# Altium schematic sheet FPGA_SDRAM.SchDoc: =ProjectName
size 420 x 297 mm; Author: G.K.; CompanyName: WUT; DrawnBy: G.K. and P.K.; Organization: WUT ISE; Address1: Warsaw Univeristy of Technology; Address2: Nowowiejska 15/19; DocumentNumber: 8; Revision: 1.1; SheetNumber: 8; SheetTotal: 12; EDA_Number: ARTIQ; Projet: ARTIQ/SINARA; ModifiedBy: -; CreateDate: XX/XX/XXXX; CheckedDate: -; Title2: FPGA_SDRAM.SchDoc; DivGrp: ISE; Designer: G.K. and P.K.; ModifiedDate: -; ProjectName: ARTIQ/SINARA
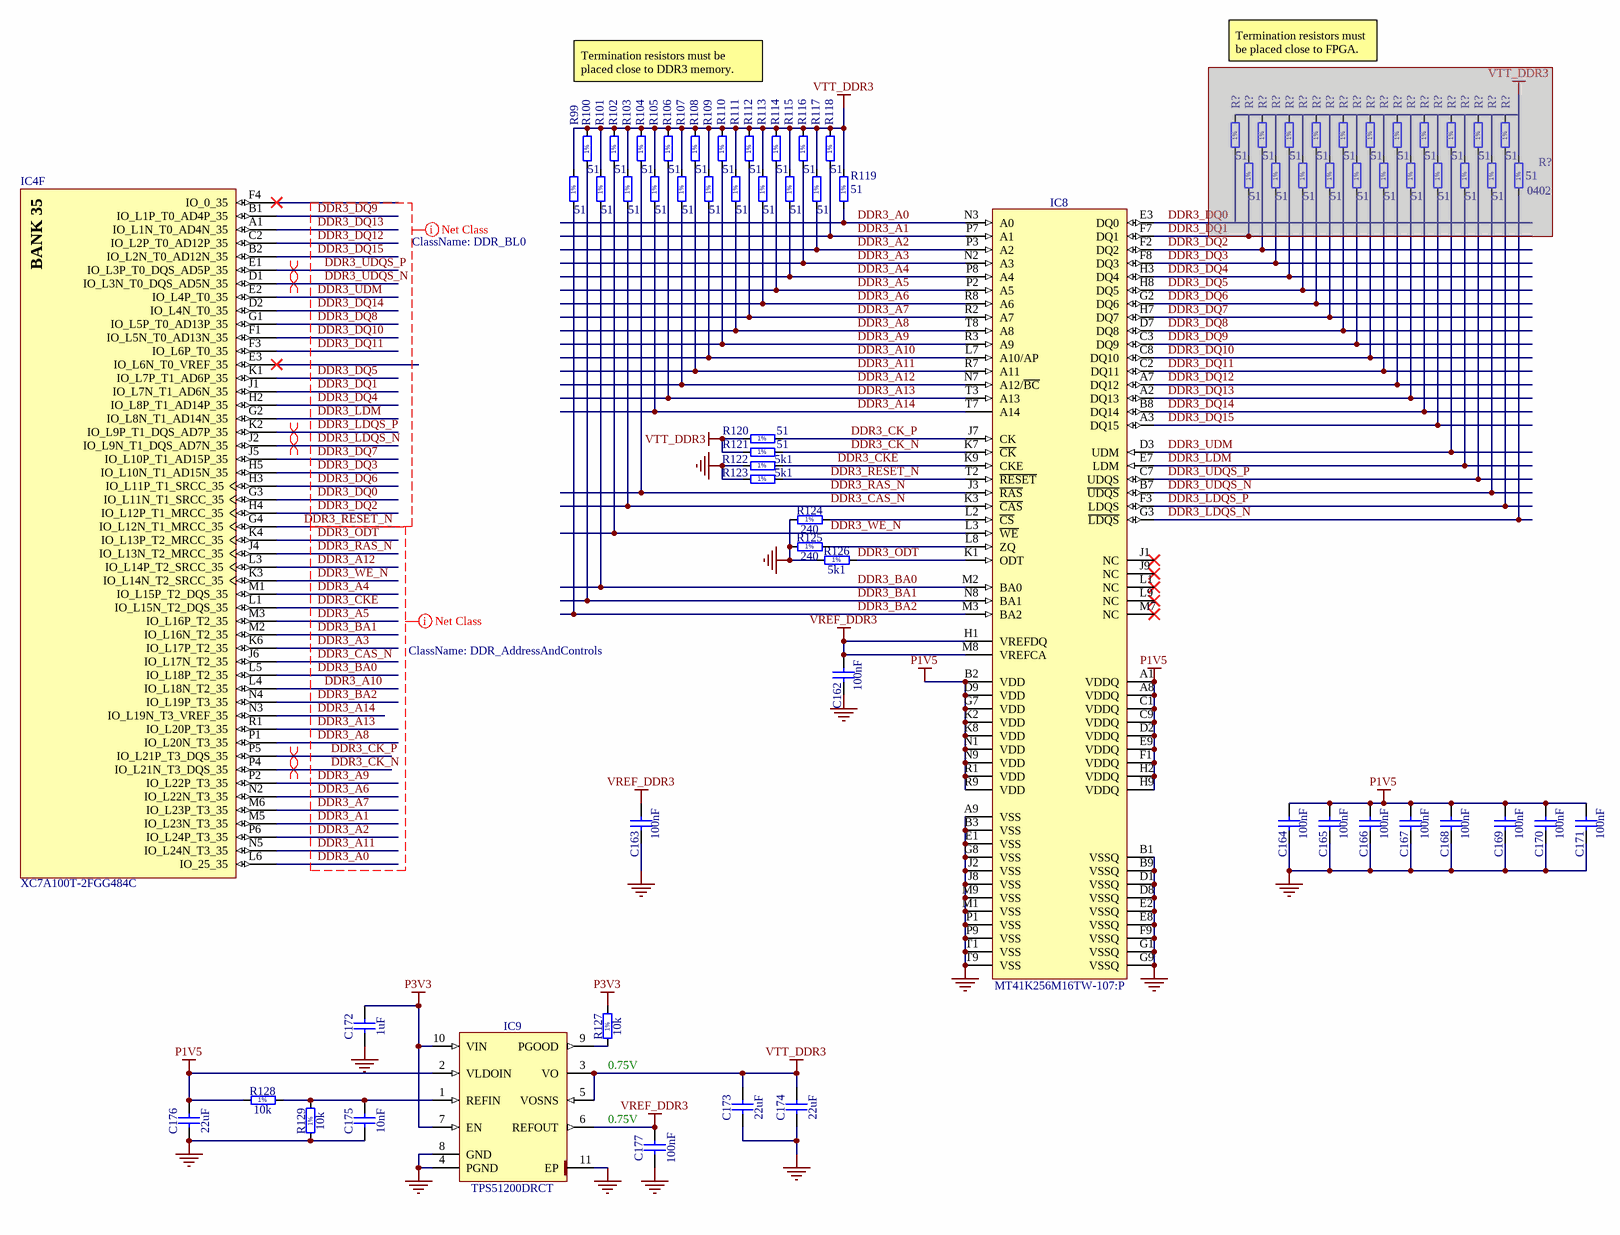
[diagram p0: FPGA_SDRAM.SchDoc]

## Parts
(Parts that share a designator on the sheet are numbered #1, #2 ... from top to bottom, then left to right.)
C162  100nF  [CAPC0603X33N]
C163  100nF  [CAPC0603X33N]
C164  100nF  [CAPC0603X33N]
C165  100nF  [CAPC0603X33N]
C166  100nF  [CAPC0603X33N]
C167  100nF  [CAPC0603X33N]
C168  100nF  [CAPC0603X33N]
C169  100nF  [CAPC0603X33N]
C170  100nF  [CAPC0603X33N]
C171  100nF  [CAPC0603X33N]
C172  1uF  [CAPC1005X55N]
C173  22uF  [CAPC1709X100N]
C174  22uF  [CAPC1709X100N]
C175  10nF  [CAPC1005X55N]
C176  22uF  [CAPC1709X100N]
C177  100nF  [CAPC0603X33N]
IC4  XC7A100T-2FGG484C  [FGG484]  (part F of 10)
IC8  MT41K256M16TW-107:P  [BGA96C80P9X16_800X1400X120]
IC9  TPS51200DRCT  [TEXAS_DRC (S-PVSON-N10)]
R99  51  [RESC1005X40N]
R100  51  [RESC1005X40N]
R101  51  [RESC1005X40N]
R102  51  [RESC1005X40N]
R103  51  [RESC1005X40N]
R104  51  [RESC1005X40N]
R105  51  [RESC1005X40N]
R106  51  [RESC1005X40N]
R107  51  [RESC1005X40N]
R108  51  [RESC1005X40N]
R109  51  [RESC1005X40N]
R110  51  [RESC1005X40N]
R111  51  [RESC1005X40N]
R112  51  [RESC1005X40N]
R113  51  [RESC1005X40N]
R114  51  [RESC1005X40N]
R115  51  [RESC1005X40N]
R116  51  [RESC1005X40N]
R117  51  [RESC1005X40N]
R118  51  [RESC1005X40N]
R119  51  [RESC1005X40N]
R120  51  [RESC1005X40N]
R121  51  [RESC1005X40N]
R122  5k1  [RESC1005X40N]
R123  5k1  [RESC1005X40N]
R124  240  [RESC1005X40N]
R125  240  [RESC1005X40N]
R126  5k1  [RESC1005X40N]
R127  10k  [RESC1005X40N]
R128  10k  [RESC1005X40N]
R129  10k  [RESC1005X40N]
R?#1  51  [RESC1005X40N]  (masked out: inside a compile mask, not in the netlist)
R?#2  51  [RESC1005X40N]  (masked out: inside a compile mask, not in the netlist)
R?#3  51  [RESC1005X40N]  (masked out: inside a compile mask, not in the netlist)
R?#4  51  [RESC1005X40N]  (masked out: inside a compile mask, not in the netlist)
R?#5  51  [RESC1005X40N]  (masked out: inside a compile mask, not in the netlist)
R?#6  51  [RESC1005X40N]  (masked out: inside a compile mask, not in the netlist)
R?#7  51  [RESC1005X40N]  (masked out: inside a compile mask, not in the netlist)
R?#8  51  [RESC1005X40N]  (masked out: inside a compile mask, not in the netlist)
R?#9  51  [RESC1005X40N]  (masked out: inside a compile mask, not in the netlist)
R?#10  51  [RESC1005X40N]  (masked out: inside a compile mask, not in the netlist)
R?#11  51  [RESC1005X40N]  (masked out: inside a compile mask, not in the netlist)
R?#12  51  [RESC1005X40N]  (masked out: inside a compile mask, not in the netlist)
R?#13  51  [RESC1005X40N]  (masked out: inside a compile mask, not in the netlist)
R?#14  51  [RESC1005X40N]  (masked out: inside a compile mask, not in the netlist)
R?#15  51  [RESC1005X40N]  (masked out: inside a compile mask, not in the netlist)
R?#16  51  [RESC1005X40N]  (masked out: inside a compile mask, not in the netlist)
R?#17  51  [RESC1005X40N]  (masked out: inside a compile mask, not in the netlist)
R?#18  51  [RESC1005X40N]  (masked out: inside a compile mask, not in the netlist)
R?#19  51  [RESC1005X40N]  (masked out: inside a compile mask, not in the netlist)
R?#20  51  [RESC1005X40N]  (masked out: inside a compile mask, not in the netlist)
R?#21  51  [RESC1005X40N]  (masked out: inside a compile mask, not in the netlist)
R?#22  51  Case: 0402  [RESC1005X40N]  (masked out: inside a compile mask, not in the netlist)

## Nets
GND: C162.1 C163.1 C164.1 C165.1 C166.1 C167.1 C168.1 C169.1 C170.1 C171.1 C172.1 C173.1 C174.1 C175.1 C176.1 C177.1 IC8.A9(VSS) IC8.B1(VSSQ) IC8.B3(VSS) IC8.B9(VSSQ) IC8.D1(VSSQ) IC8.D8(VSSQ) IC8.E1(VSS) IC8.E2(VSSQ) IC8.E8(VSSQ) IC8.F9(VSSQ) IC8.G1(VSSQ) IC8.G8(VSS) IC8.G9(VSSQ) IC8.J2(VSS) IC8.J8(VSS) IC8.M1(VSS) IC8.M9(VSS) IC8.P1(VSS) IC8.P9(VSS) IC8.T1(VSS) IC8.T9(VSS) IC9.4(PGND) IC9.8(GND) IC9.11(EP) R122.1 R123.1 R124.1 R125.1 R126.1 R129.1
P1V5: C164.2 C165.2 C166.2 C167.2 C168.2 C169.2 C170.2 C171.2 C176.2 IC8.A1(VDDQ) IC8.A8(VDDQ) IC8.B2(VDD) IC8.C1(VDDQ) IC8.C9(VDDQ) IC8.D2(VDDQ) IC8.D9(VDD) IC8.E9(VDDQ) IC8.F1(VDDQ) IC8.G7(VDD) IC8.H2(VDDQ) IC8.H9(VDDQ) IC8.K2(VDD) IC8.K8(VDD) IC8.N1(VDD) IC8.N9(VDD) IC8.R1(VDD) IC8.R9(VDD) IC9.2(VLDOIN) R128.1
P3V3: C172.2 IC9.7(EN) IC9.10(VIN) R127.2
VREF_DDR3: C162.2 C163.2 C177.2 IC8.H1(VREFDQ) IC8.M8(VREFCA) IC9.6(REFOUT)
VTT_DDR3: C173.2 C174.2 IC9.3(VO) IC9.5(VOSNS) R99.2 R100.2 R101.2 R102.2 R103.2 R104.2 R105.2 R106.2 R107.2 R108.2 R109.2 R110.2 R111.2 R112.2 R113.2 R114.2 R115.2 R116.2 R117.2 R118.2 R119.2 R120.1 R121.1
DDR3_A0: IC4.L6(IO_25_35) IC8.N3(A0) R119.1
DDR3_A1: IC4.M5(IO_L23N_T3_35) IC8.P7(A1) R118.1
DDR3_A2: IC4.P6(IO_L24P_T3_35) IC8.P3(A2) R117.1
DDR3_A3: IC4.K6(IO_L17P_T2_35) IC8.N2(A3) R116.1
DDR3_A4: IC4.M1(IO_L15P_T2_DQS_35) IC8.P8(A4) R115.1
DDR3_A5: IC4.M3(IO_L16P_T2_35) IC8.P2(A5) R114.1
DDR3_A6: IC4.N2(IO_L22N_T3_35) IC8.R8(A6) R113.1
DDR3_A7: IC4.M6(IO_L23P_T3_35) IC8.R2(A7) R112.1
DDR3_A8: IC4.P1(IO_L20N_T3_35) IC8.T8(A8) R111.1
DDR3_A9: IC4.P2(IO_L22P_T3_35) IC8.R3(A9) R110.1
DDR3_A10: IC4.L4(IO_L18N_T2_35) IC8.L7(A10/AP) R109.1
DDR3_A11: IC4.N5(IO_L24N_T3_35) IC8.R7(A11) R108.1
DDR3_A12: IC4.L3(IO_L14P_T2_SRCC_35) IC8.N7(A12/~{BC}) R107.1
DDR3_A13: IC4.R1(IO_L20P_T3_35) IC8.T3(A13) R106.1
DDR3_A14: IC4.N3(IO_L19N_T3_VREF_35) IC8.T7(A14) R105.1
DDR3_BA0: IC4.L5(IO_L18P_T2_35) IC8.M2(BA0) R101.1
DDR3_BA1: IC4.M2(IO_L16N_T2_35) IC8.N8(BA1) R100.1
DDR3_BA2: IC4.N4(IO_L19P_T3_35) IC8.M3(BA2) R99.1
DDR3_CAS_N: IC4.J6(IO_L17N_T2_35) IC8.K3(~{CAS}) R103.1
DDR3_CK_N: IC4.P4(IO_L21N_T3_DQS_35) IC8.K7(~{CK}) R121.2
DDR3_CK_P: IC4.P5(IO_L21P_T3_DQS_35) IC8.J7(CK) R120.2
DDR3_CKE: IC4.L1(IO_L15N_T2_DQS_35) IC8.K9(CKE) R122.2
DDR3_DQ0: IC4.G3(IO_L11N_T1_SRCC_35) IC8.E3(DQ0)
DDR3_DQ1: IC4.J1(IO_L7N_T1_AD6N_35) IC8.F7(DQ1)
DDR3_DQ2: IC4.H4(IO_L12P_T1_MRCC_35) IC8.F2(DQ2)
DDR3_DQ3: IC4.H5(IO_L10N_T1_AD15N_35) IC8.F8(DQ3)
DDR3_DQ4: IC4.H2(IO_L8P_T1_AD14P_35) IC8.H3(DQ4)
DDR3_DQ5: IC4.K1(IO_L7P_T1_AD6P_35) IC8.H8(DQ5)
DDR3_DQ6: IC4.H3(IO_L11P_T1_SRCC_35) IC8.G2(DQ6)
DDR3_DQ7: IC4.J5(IO_L10P_T1_AD15P_35) IC8.H7(DQ7)
DDR3_DQ8: IC4.G1(IO_L5P_T0_AD13P_35) IC8.D7(DQ8)
DDR3_DQ9: IC4.B1(IO_L1P_T0_AD4P_35) IC8.C3(DQ9)
DDR3_DQ10: IC4.F1(IO_L5N_T0_AD13N_35) IC8.C8(DQ10)
DDR3_DQ11: IC4.F3(IO_L6P_T0_35) IC8.C2(DQ11)
DDR3_DQ12: IC4.C2(IO_L2P_T0_AD12P_35) IC8.A7(DQ12)
DDR3_DQ13: IC4.A1(IO_L1N_T0_AD4N_35) IC8.A2(DQ13)
DDR3_DQ14: IC4.D2(IO_L4N_T0_35) IC8.B8(DQ14)
DDR3_DQ15: IC4.B2(IO_L2N_T0_AD12N_35) IC8.A3(DQ15)
DDR3_LDM: IC4.G2(IO_L8N_T1_AD14N_35) IC8.E7(LDM)
DDR3_LDQS_N: IC4.J2(IO_L9N_T1_DQS_AD7N_35) IC8.G3(~{LDQS})
DDR3_LDQS_P: IC4.K2(IO_L9P_T1_DQS_AD7P_35) IC8.F3(LDQS)
DDR3_ODT: IC4.K4(IO_L13P_T2_MRCC_35) IC8.K1(ODT) R126.2
DDR3_RAS_N: IC4.J4(IO_L13N_T2_MRCC_35) IC8.J3(~{RAS}) R104.1
DDR3_RESET_N: IC4.G4(IO_L12N_T1_MRCC_35) IC8.T2(~{RESET}) R123.2
DDR3_UDM: IC4.E2(IO_L4P_T0_35) IC8.D3(UDM)
DDR3_UDQS_N: IC4.D1(IO_L3N_T0_DQS_AD5N_35) IC8.B7(~{UDQS})
DDR3_UDQS_P: IC4.E1(IO_L3P_T0_DQS_AD5P_35) IC8.C7(UDQS)
DDR3_WE_N: IC4.K3(IO_L14N_T2_SRCC_35) IC8.L3(~{WE}) R102.1
NetC175_2: C175.2 IC9.1(REFIN) R128.2 R129.2
NetIC8_L2: IC8.L2(~{CS}) R124.2
NetIC8_L8: IC8.L8(ZQ) R125.2
NetIC9_9: IC9.9(PGOOD) R127.1

Not connected (* = marked no-connect by the designer): IC4 E3(IO_L6N_T0_VREF_35)* F4(IO_0_35)*; IC8 J1(NC)* J9(NC)* L1(NC)* L9(NC)* M7(NC)*

## Layout directives
differential pair: DDR3_CK_N, DDR3_CK_P, DDR3_LDQS_N, DDR3_LDQS_P, DDR3_UDQS_N, DDR3_UDQS_P
net class DDR_AddressAndControls; net class 50Ohm: DDR3_A0, DDR3_A1, DDR3_A2, DDR3_A3, DDR3_A4, DDR3_A5, DDR3_A6, DDR3_A7, DDR3_A8, DDR3_A9, DDR3_A10, DDR3_A11, DDR3_A12, DDR3_A13, DDR3_A14, DDR3_BA0, DDR3_BA1, DDR3_BA2, DDR3_CAS_N, DDR3_CK_N, DDR3_CK_P, DDR3_CKE, DDR3_ODT, DDR3_RAS_N, DDR3_WE_N
net class DDR_BL0; net class 50Ohm: DDR3_DQ0, DDR3_DQ1, DDR3_DQ2, DDR3_DQ3, DDR3_DQ4, DDR3_DQ5, DDR3_DQ6, DDR3_DQ7, DDR3_DQ8, DDR3_DQ9, DDR3_DQ10, DDR3_DQ11, DDR3_DQ12, DDR3_DQ13, DDR3_DQ14, DDR3_DQ15, DDR3_LDM, DDR3_LDQS_N, DDR3_LDQS_P, DDR3_UDM, DDR3_UDQS_N, DDR3_UDQS_P

## Notes on the sheet
- Termination resistors must be placed close to FPGA.
- Termination resistors must be placed close to DDR3 memory.
- (near R127) 0.75V
- (near C177) 0.75V
- (in symbol CMP-0364-00026-3, part F) BANK 35
- (in symbol R0402_5K1_1%_0.0625W_100PPM) 1%
- (in symbol R0402_10K_1%_0.0625W_100PPM) 1%
- (in symbol R0402_51R_1%_0.0625W_100PPM) 1%
- (in symbol R0402_240R_1%_0.0625W_100PPM) 1%

## Library data of the parts
C162-C171 C177 = CC0201_100NF_6.3V_10%_X5R: Non-polarised capacitor; Part Description: SMD Multilayer Chip Ceramic Capacitor; Manufacturer: GENERIC; Manufacturer1 Part Number: 02016D104KAT2A; Voltage: 6.3V; TC: X5R; Tolerance: ±10%; Part Number: CC0201_100NF_6.3V_10%_X5R; Component Kind: Standard; Component Type: Standard; Pin Count: 2; Value: 100nF; Status: Not Recommended; Manufacturer Part Number: CC0201_100NF_6.3V_10%_X5R; Case: 0201; Mounted: Yes; Socket: No; SMD: Yes; Sense: No; Manufacturer1 Example: AVX; Manufacturer1 ComponentHeight: 0.33mm; HelpURL: \\cern.ch\dfs\Applications\Altium\Datasheets\CC0201_X5R_AVX.pdf; Author: CERN DEM JLC
  C162-C171: CreateDate: 2007-12-03; LatestRevisionDate: 2007-12-03
  C177: CreateDate: 03.12.2007; LatestRevisionDate: 03.12.2007
C172 = CC0402_1UF_16V_10%_X5R: Non-polarised capacitor; Part Description: SMD Multilayer Chip Ceramic Capacitor; Manufacturer: GENERIC; Manufacturer1 Part Number: C1005X5R1C105KT; Voltage: 16V; TC: X5R; Tolerance: ±10%; Part Number: CC0402_1UF_16V_10%_X5R; Component Kind: Standard; Component Type: Standard; Pin Count: 2; Value: 1uF; Status: Preferred; Manufacturer Part Number: CC0402_1UF_16V_10%_X5R; Case: 0402; Mounted: Yes; Socket: No; SMD: Yes; Manufacturer1 Example: TDK; Manufacturer1 ComponentHeight: 0.55mm; HelpURL: \\cern.ch\dfs\Applications\Altium\Datasheets\CC0402_X5R_TDK_C.pdf; Author: CERN DEM JLC; CreateDate: 25.10.2012; LatestRevisionDate: 25.10.2012; Sense: No
C173 C174 C176 = CC0603_22UF_6.3V_20%_X5R: Non-polarised capacitor; Part Description: SMD Multilayer Chip Ceramic Capacitor; Manufacturer: GENERIC; Manufacturer1 Part Number: C1608X5R0J226M080AC; Voltage: 6.3V; TC: X5R; Tolerance: ±20%; Part Number: CC0603_22UF_6.3V_20%_X5R; Component Kind: Standard; Component Type: Standard; Pin Count: 2; Value: 22uF; Status: None; Manufacturer Part Number: CC0603_22UF_6.3V_20%_X5R; Case: 0603; Mounted: Yes; Socket: No; SMD: Yes; Manufacturer1 Example: TDK; Manufacturer1 ComponentHeight: 1mm; HelpURL: \\cern.ch\dfs\Applications\Altium\Datasheets\CC0603_X5R_TDK_C.pdf; Author: CERN DEM JLC; CreateDate: 16.12.2013; LatestRevisionDate: 13.09.2016; Sense: No
C175 = CC0402_10NF_16V_10%_X7R: Non-polarised capacitor; Part Description: SMD Multilayer Chip Ceramic Capacitor; Manufacturer: GENERIC; Manufacturer1 Part Number: 223878715636; Voltage: 16V; TC: X7R; Tolerance: ±10%; Part Number: CC0402_10NF_16V_10%_X7R; Component Kind: Standard; Component Type: Standard; Pin Count: 2; Value: 10nF; Status: Not Recommended; Manufacturer Part Number: CC0402_10NF_16V_10%_X7R; Case: 0402; Mounted: Yes; Socket: No; SMD: Yes; Manufacturer1 Example: PHYCOMP; Manufacturer1 ComponentHeight: 0.55mm; HelpURL: \\cern.ch\dfs\Applications\Altium\Datasheets\CC0402_X7R_PHYCOMP.pdf; Author: CERN DEM JLC; CreateDate: 03.12.2007; LatestRevisionDate: 03.12.2007; Sense: No
IC4 = CMP-0364-00026-3: Artix-7 FPGA, 285 User I/Os, 4 GTP, 484-Ball BGA, Speed Grade 2, Commercial Grade, Pb-Free; Manufacturer: Xilinx; Max User I/O: 300; Clock Mgmt Tiles (CMTs): 6; Logic Cells: 101440; Block RAM Blocks (36Kb): 135; Block RAM Blocks (18Kb): 270; Speed Grade: -2; CLBs (Slices): 15850; Block RAM Blocks (Max Kb): 4860; DSP48E1 Slices: 240; RoHS: Pb-Free; ComponentLink3URL: http://www.xilinx.com/support/documentation/data_sheets/ds181_Artix_7_Data_Sheet.pdf; NexusDeviceID: XC7A100T-2FGG484C; DatasheetVersion: v1.12; Mounting Technology: Surface Mount; PackageDescription: Wire-Bond Fine-Pitch BGA, Body 23 x 23 mm, 1.0 mm Pitch; PackageReference: FGG484; ComponentLink2Description: Package Specification; Code_JEDEC: MS-034-AAJ-1; ComponentLink2URL: http://www.xilinx.com/support/documentation/user_guides/ug475_7Series_Pkg_Pinout.pdf; ComponentLink3Description: DC and Switching Characteristics; Generic Part Number: XC7A100T; ComponentLink4Description: Package File; ComponentLink4URL: http://www.xilinx.com/support/packagefiles/a7packages/xc7a100tfgg484pkg.txt; ComponentLink1URL: http://www.xilinx.com/support/documentation/data_sheets/ds180_7Series_Overview.pdf; PartNumber: XC7A100T-2FGG484C; ComponentLink5URL: http://www.xilinx.com/support/documentation/user_guides/ug475_7Series_Pkg_Pinout.pdf; PackageVersion: Rev 1.8; ComponentLink5Description: Packaging and Pinout; ComponentLink1Description: Datasheet; CLBs (Max Distributed RAM Kb): 1188; ClassName: Artix
IC8 = MT41K256M16TW-107:P: 32 Meg x 16 x 8 Banks DDR3L SDRAM; Part Description: +1.5V, 4Gb (32Meg x 16 x 8 banks) DDR3L SDRAM; Manufacturer: MICRON TECHNOLOGY; PressFit: No; Bonding: No; Part Number: MT41K256M16TW-107:P; Component Kind: Standard; Component Type: Standard; Device: MT41K256M16TW-107:P; PackageDescription: BGA 0.8mm, Pitch, Square 96 Pin, 9 Columns x 16 Rows, Body 14mm X 8mm X 1.2mm H; Manufacturer Part Number: MT41K256M16TW-107:P; Pin Count: 96; Case: BGA96; Mounted: Yes; Socket: No; SMD: Yes; Sense: No; ComponentHeight: 1.2mm; HelpURL: \\cern.ch\dfs\Applications\Altium\Datasheets\MT41K256M16TW-107-P.pdf; Author: CERN DEM MR; CreateDate: 2015-12-14; LatestRevisionDate: 2015-12-14
IC9 = TPS51200DRCT: Sink/Source DDR Termination Regulator; Part Description: 3.3V Sink/Source DDR Termination Regulator; Manufacturer: TEXAS INSTRUMENTS; PressFit: No; Bonding: No; Part Number: TPS51200DRCT; Component Kind: Standard; Component Type: Standard; Device: TPS51200DRCT; PackageDescription: SON, 0.50mm Pitch, 10-pin, 3.00mm W  X 3.00mm L X 1.00mm Height, (w/thermal tab 1.75 X 2.50 mm); Manufacturer Part Number: TPS51200DRCT; Pin Count: 11; Case: SON10; Mounted: Yes; Socket: No; SMD: Yes; Sense: No; ComponentHeight: 1mm; HelpURL: \\cern.ch\dfs\Applications\Altium\Datasheets\TPS51200DRCT.pdf; Author: CERN DEM JLC; CreateDate: 03.02.2010; LatestRevisionDate: 06.11.2013
R99-R121 R?#1-R?#22 = R0402_51R_1%_0.0625W_100PPM: Resistor - 1%; Part Description: General Purpose Thick Film Chip Resistor; Manufacturer: GENERIC; Manufacturer1 Part Number: 232270675109; TC: ±100ppm/°C; Table: Resistors SMD; Part Number: R0402_51R_1%_0.0625W_100PPM; Component Kind: Standard; Component Type: Standard; Pin Count: 2; Value: 51; Status: Not recommended; Power: 0.0625W; Tolerance: ±1%; Manufacturer Part Number: R0402_51R_1%_0.0625W_100PPM; Mounted: Yes; Socket: No; SMD: Yes; Manufacturer1 Example: PHYCOMP; Manufacturer1 ComponentHeight: 0.4mm; HelpURL: \\cern.ch\dfs\Applications\Altium\Datasheets\R0402_Phycomp_RC0402.pdf; Author: CERN DEM JLC; CreateDate: 03/12/2007; LatestRevisionDate: 13/03/2008
  R99-R118 R120 R121 R?#1-R?#21: Case: 0402
R122 R123 R126 = R0402_5K1_1%_0.0625W_100PPM: Resistor - 1%; Part Description: General Purpose Thick Film Chip Resistor; Manufacturer: GENERIC; Manufacturer1 Part Number: 232270675102L; TC: ±100ppm/°C; PressFit: No; Part Number: R0402_5K1_1%_0.0625W_100PPM; Component Kind: Standard; Component Type: Standard; Pin Count: 2; Value: 5k1; Status: Not Recommended; Power: 0.0625W; Tolerance: ±1%; Manufacturer Part Number: R0402_5K1_1%_0.0625W_100PPM; Case: 0402; Mounted: Yes; Sense: No; Socket: No; SMD: Yes; Manufacturer1 Example: YAGEO PHYCOMP; Manufacturer1 ComponentHeight: 0.4mm; HelpURL: \\cern.ch\dfs\Applications\Altium\Datasheets\R0402_Phycomp_RC0402.pdf; Author: CERN DEM JLC; CreateDate: 03.12.2007; LatestRevisionDate: 17.10.2012
R124 R125 = R0402_240R_1%_0.0625W_100PPM: Resistor - 1%; Part Description: General Purpose Thick Film Chip Resistor; Manufacturer: GENERIC; Manufacturer1 Part Number: 232270672401L; TC: ±100ppm/°C; PressFit: No; Part Number: R0402_240R_1%_0.0625W_100PPM; Component Kind: Standard; Component Type: Standard; Pin Count: 2; Value: 240; Status: Not Recommended; Power: 0.0625W; Tolerance: ±1%; Manufacturer Part Number: R0402_240R_1%_0.0625W_100PPM; Case: 0402; Mounted: Yes; Sense: No; Socket: No; SMD: Yes; Manufacturer1 Example: YAGEO PHYCOMP; Manufacturer1 ComponentHeight: 0.4mm; HelpURL: \\cern.ch\dfs\Applications\Altium\Datasheets\R0402_Phycomp_RC0402.pdf; Author: CERN DEM JLC; CreateDate: 03.12.2007; LatestRevisionDate: 17.10.2012
R127-R129 = R0402_10K_1%_0.0625W_100PPM: Resistor - 1%; Part Description: General Purpose Thick Film Chip Resistor; Manufacturer: GENERIC; Manufacturer1 Part Number: 232270671003L; TC: ±100ppm/°C; PressFit: No; Part Number: R0402_10K_1%_0.0625W_100PPM; Component Kind: Standard; Component Type: Standard; Pin Count: 2; Value: 10k; Status: Not Recommended; Power: 0.0625W; Tolerance: ±1%; Manufacturer Part Number: R0402_10K_1%_0.0625W_100PPM; Case: 0402; Mounted: Yes; Socket: No; SMD: Yes; Manufacturer1 Example: YAGEO PHYCOMP; Manufacturer1 ComponentHeight: 0.4mm; HelpURL: \\cern.ch\dfs\Applications\Altium\Datasheets\R0402_Phycomp_RC0402.pdf; Author: CERN DEM JLC; CreateDate: 03.12.2007; LatestRevisionDate: 17.10.2012; Sense: No